# Altium schematic sheet MainCtrl.SchDoc
size A3
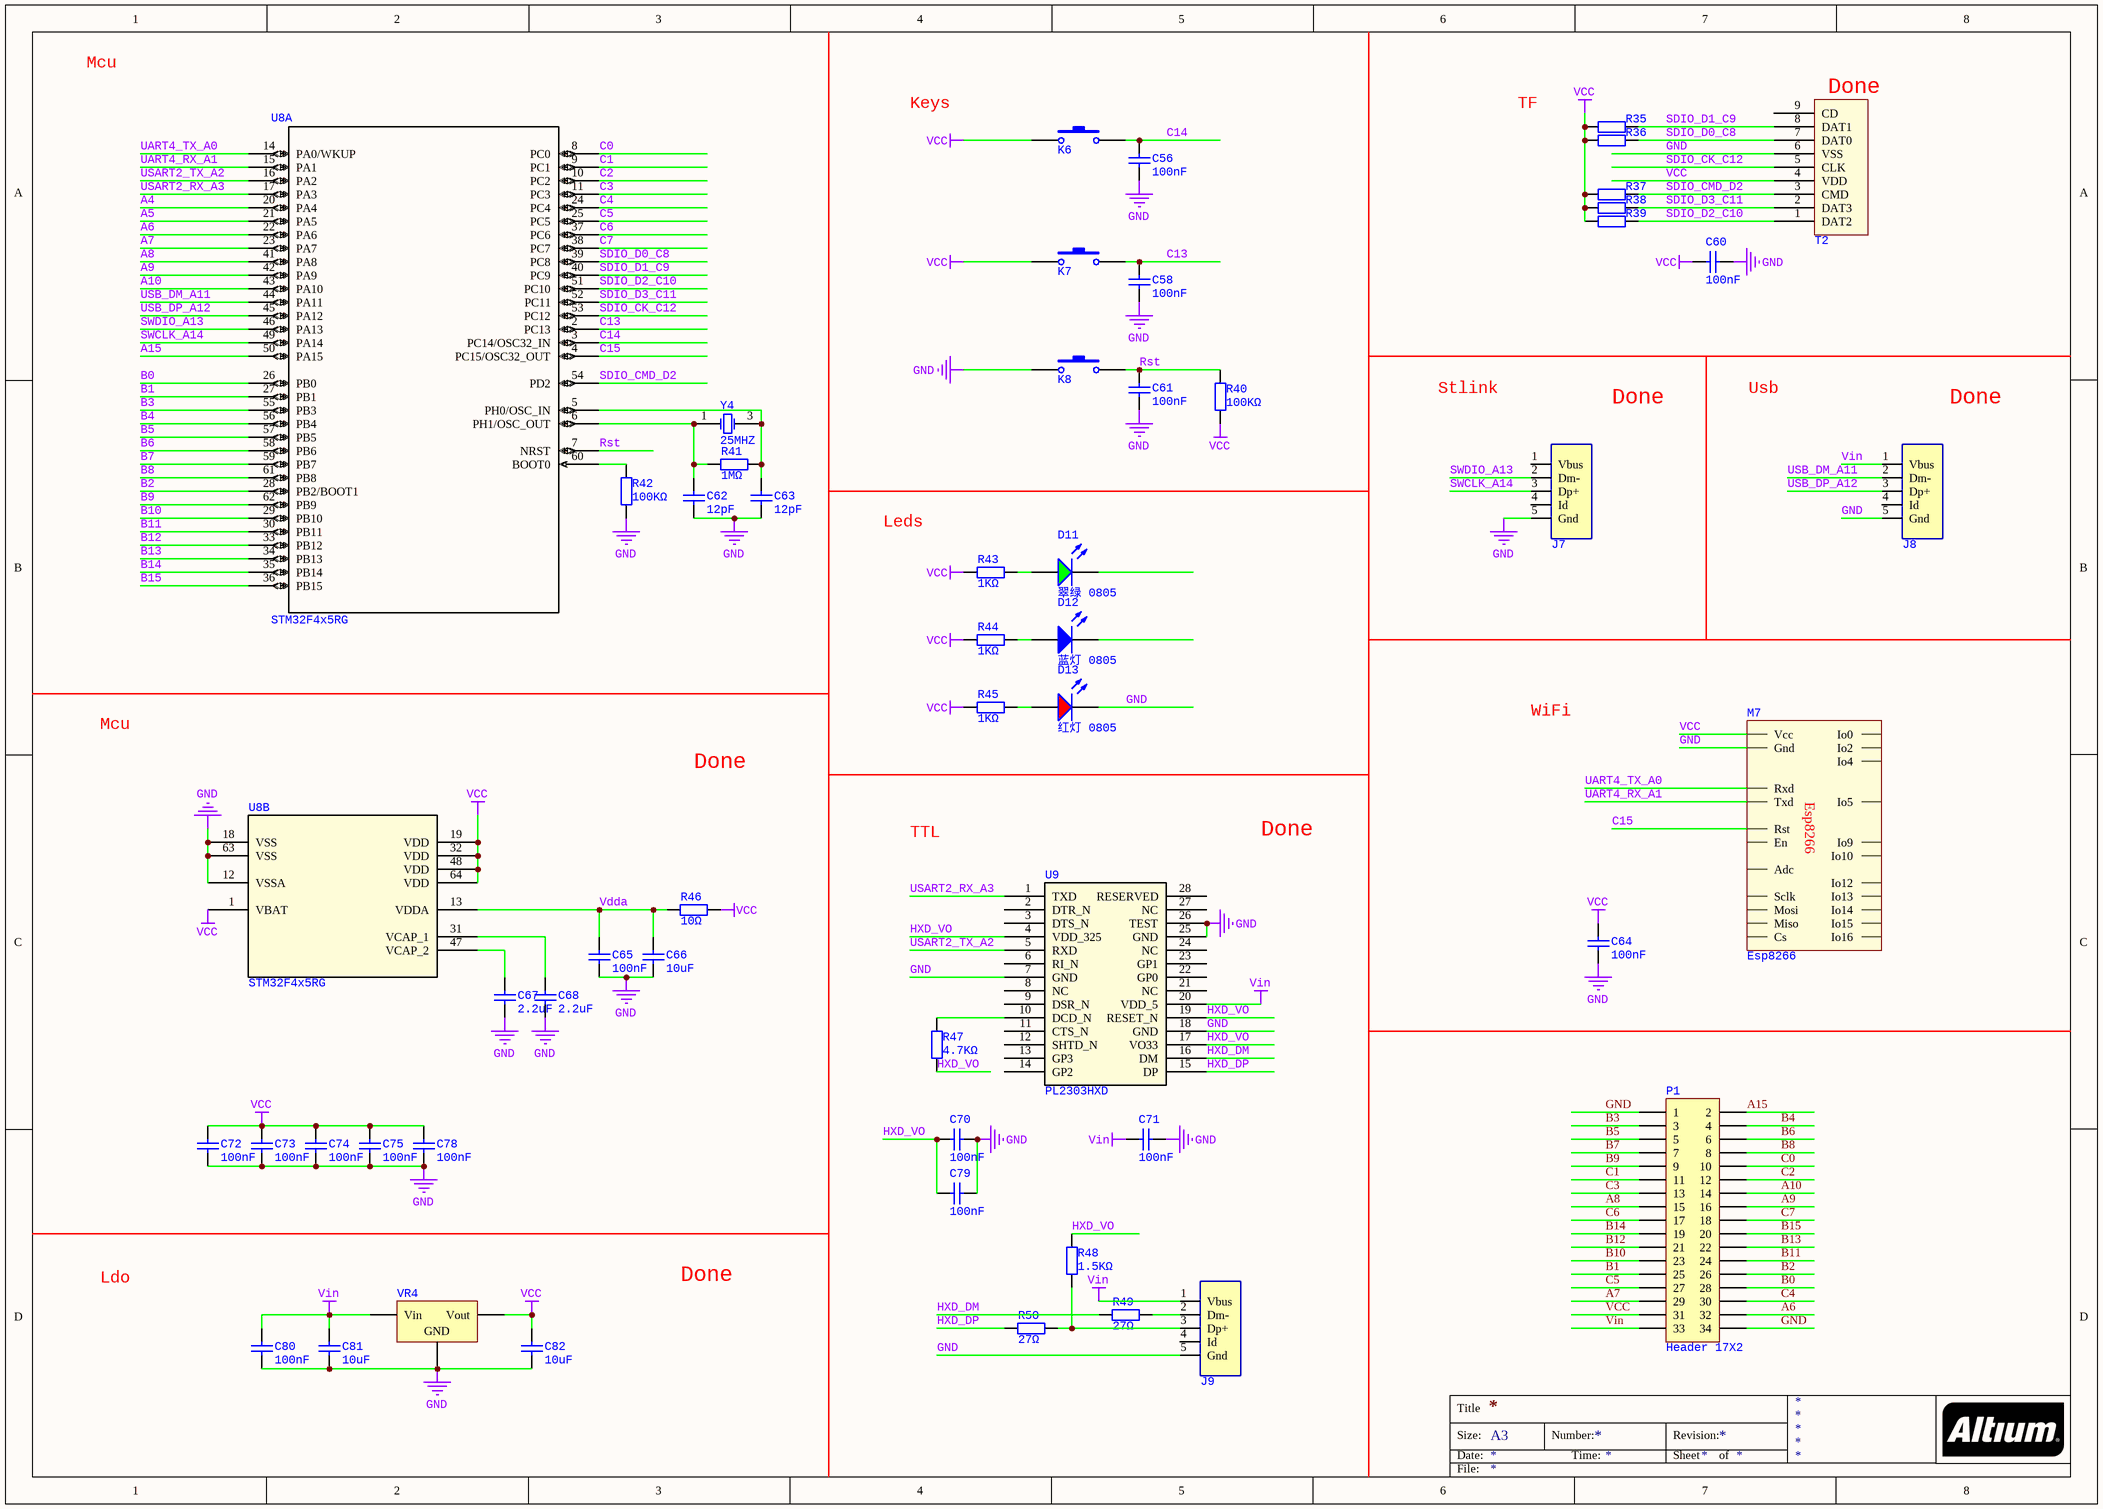
[diagram p0: MainCtrl.SchDoc]

## Parts
C56  100nF  [0603_C]
C58  100nF  [0603_C]
C60  100nF  [0603_C]
C61  100nF  [0603_C]
C62  12pF  [0603_C]
C63  12pF  [0603_C]
C64  100nF  [0603_C]
C65  100nF  [0603_C]
C66  10uF  [0603_C]
C67  2.2uF  [0603_C]
C68  2.2uF  [0603_C]
C70  100nF  [0603_C]
C71  100nF  [0603_C]
C72  100nF  [0603_C]
C73  100nF  [0603_C]
C74  100nF  [0603_C]
C75  100nF  [0603_C]
C78  100nF  [0603_C]
C79  100nF  [0603_C]
C80  100nF  [0603_C]
C81  10uF  [0805_C]
C82  10uF  [0805_C]
D11  翠绿 0805  [0805_LED_S1]
D12  蓝灯 0805  [0805_LED_S1]
D13  红灯 0805  [0805_LED_S1]
J7  UsbOtg  [USB-MINI-A]  (value not drawn)
J8  UsbOtg  [USB-MICRO_E]  (value not drawn)
J9  UsbOtg  [USB-MICRO_E]  (value not drawn)
K6  SW  [SWITCH]  (value not drawn)
K7  SW  [SWITCH]  (value not drawn)
K8  SW  [SWITCH]  (value not drawn)
M7  Esp8266  [ESP8266]
P1  Header 17X2  [P17X2]
R35  47KΩ  [0603_R]  (value not drawn)
R36  47KΩ  [0603_R]  (value not drawn)
R37  47KΩ  [0603_R]  (value not drawn)
R38  47KΩ  [0603_R]  (value not drawn)
R39  47KΩ  [0603_R]  (value not drawn)
R40  100KΩ  [0603_R]
R41  1MΩ  [0603_R]
R42  100KΩ  [0603_R]
R43  1KΩ  [0603_R]
R44  1KΩ  [0603_R]
R45  1KΩ  [0603_R]
R46  10Ω  [0603_R]
R47  4.7KΩ  [0603_R]
R48  1.5KΩ  [0603_R]
R49  27Ω  [0603_R]
R50  27Ω  [0603_R]
T2  TFCard  [TF-CARD]  (value not drawn)
U8  STM32F4x5RG  [LQFP64]  (parts A,B of 2)
U9  PL2303HXD  [SSOP28]
VR4  AMS1117-3.3  [SOT-223]  (value not drawn)
Y4  25MHZ  [SMD-3225_4P]

## Nets
GND: C56.1 C58.1 C60.2 C61.1 C62.1 C63.1 C64.1 C65.1 C66.1 C67.1 C68.1 C70.1 C71.1 C72.1 C73.1 C74.1 C75.1 C78.1 C79.1 C80.1 C81.1 C82.1 D13.K J7.5(Gnd) J8.5(Gnd) J9.5(Gnd) K8.1 M7.15(Gnd) P1.1 P1.34 R42.1 T2.6(VSS) U8.12(VSSA) U8.18(VSS) U8.63(VSS) U9.7(GND) U9.18(GND) U9.25(GND) U9.26(TEST) VR4.1(GND)
VCC: C60.1 C64.2 C72.2 C73.2 C74.2 C75.2 C78.2 C82.2 K6.1 K7.1 M7.8(Vcc) P1.31 R35.1 R36.1 R37.1 R38.1 R39.1 R40.1 R43.2 R44.2 R45.2 R46.2 T2.4(VDD) U8.1(VBAT) U8.19(VDD) U8.32(VDD) U8.48(VDD) U8.64(VDD) VR4.2(Vout)
Vin: C71.2 C80.2 C81.2 J8.1(Vbus) J9.1(Vbus) P1.33 U9.20(VDD_5) VR4.3(Vin)
A4: U8.20(PA4)
A5: U8.21(PA5)
A6: P1.32 U8.22(PA6)
A7: P1.29 U8.23(PA7)
A8: P1.15 U8.41(PA8)
A9: P1.16 U8.42(PA9)
A10: P1.14 U8.43(PA10)
A15: P1.2 U8.50(PA15)
B0: P1.28 U8.26(PB0)
B1: P1.25 U8.27(PB1)
B2: P1.26 U8.28(PB2/BOOT1)
B3: P1.3 U8.55(PB3)
B4: P1.4 U8.56(PB4)
B5: P1.5 U8.57(PB5)
B6: P1.6 U8.58(PB6)
B7: P1.7 U8.59(PB7)
B8: P1.8 U8.61(PB8)
B9: P1.9 U8.62(PB9)
B10: P1.23 U8.29(PB10)
B11: P1.24 U8.30(PB11)
B12: P1.21 U8.33(PB12)
B13: P1.22 U8.34(PB13)
B14: P1.19 U8.35(PB14)
B15: P1.20 U8.36(PB15)
C0: P1.10 U8.8(PC0)
C1: P1.11 U8.9(PC1)
C2: P1.12 U8.10(PC2)
C3: P1.13 U8.11(PC3)
C4: P1.30 U8.24(PC4)
C5: P1.27 U8.25(PC5)
C6: P1.17 U8.37(PC6)
C7: P1.18 U8.38(PC7)
C13: C58.2 K7.2 U8.2(PC13)
C14: C56.2 K6.2 U8.3(PC14/OSC32_IN)
C15: M7.1(Rst) U8.4(PC15/OSC32_OUT)
HXD_DM: R49.1 U9.16(DM)
HXD_DP: R50.1 U9.15(DP)
HXD_VO: C70.2 C79.2 R47.2 R48.2 U9.4(VDD_325) U9.17(VO33) U9.19(RESET_N)
Rst: C61.2 K8.2 R40.2 U8.7(NRST)
SDIO_CK_C12: T2.5(CLK) U8.53(PC12)
SDIO_CMD_D2: R37.2 T2.3(CMD) U8.54(PD2)
SDIO_D0_C8: R36.2 T2.7(DAT0) U8.39(PC8)
SDIO_D1_C9: R35.2 T2.8(DAT1) U8.40(PC9)
SDIO_D2_C10: R39.2 T2.1(DAT2) U8.51(PC10)
SDIO_D3_C11: R38.2 T2.2(DAT3) U8.52(PC11)
SWCLK_A14: J7.3(Dp+) U8.49(PA14)
SWDIO_A13: J7.2(Dm-) U8.46(PA13)
UART4_RX_A1: M7.22(Txd) U8.15(PA1)
UART4_TX_A0: M7.21(Rxd) U8.14(PA0/WKUP)
USART2_RX_A3: U8.17(PA3) U9.1(TXD)
USART2_TX_A2: U8.16(PA2) U9.5(RXD)
USB_DM_A11: J8.2(Dm-) U8.44(PA11)
USB_DP_A12: J8.3(Dp+) U8.45(PA12)
Vdda: C65.2 C66.2 R46.1 U8.13(VDDA)
NetC62_2: C62.2 R41.1 U8.6(PH1/OSC_OUT) Y4.1(OSC1)
NetC63_2: C63.2 R41.2 U8.5(PH0/OSC_IN) Y4.3(OSC2)
NetC67_2: C67.2 U8.47(VCAP_2)
NetC68_2: C68.2 U8.31(VCAP_1)
NetD11_A: D11.A R43.1
NetD12_A: D12.A R44.1
NetD13_A: D13.A R45.1
NetJ9_2: J9.2(Dm-) R49.2
NetJ9_3: J9.3(Dp+) R48.1 R50.2
NetR42_2: R42.2 U8.60(BOOT0)
NetR47_1: R47.1 U9.10(DCD_N)

Not connected (* = marked no-connect by the designer): D11 K; D12 K; J7 1(Vbus) 4(Id); J8 4(Id); J9 4(Id); M7 2(Adc) 3(En) 4(Io16) 5(Io14) 6(Io12) 7(Io13) 9(Sclk) 10(Mosi) 11(Io10) 12(Io9) 13(Miso) 14(Cs) 16(Io15) 17(Io2) 18(Io0) 19(Io4) 20(Io5); T2 9(CD); U9 2(DTR_N) 3(DTS_N) 6(RI_N) 8(NC) 9(DSR_N) 11(CTS_N) 12(SHTD_N) 13(GP3) 14(GP2) 21(NC) 22(GP0) 23(GP1) 24(NC) 27(NC) 28(RESERVED)

## Notes on the sheet
- Mcu
- Keys
- TF
- (near T2) Done
- Stlink
- Done
- Usb
- Leds
- WiFi
- TTL
- Ldo
- Title
- Size:
- Date:
- A3
- Number:
- Time:
- Revision:
- Sheet
- of
- File:

## Library data of the parts
C56 C58 C60 C61 C64 C65 C70-C75 C78-C80 = 0603 100nF (104) 10% 50V: 贴片电容; ComponentLink1Description: 供应商链接; ComponentLink1URL: http://www.szlcsc.com/product/details_15331.html; Package: 0603; Supplier: LC; SuppliersPartNumber: C14663
C62 C63 = 0603 12pF (120) 5% 50V: 贴片电容; ComponentLink1Description: 供应商链接; ComponentLink1URL: http://www.szlcsc.com/product/details_39506.html; Package: 0603; Supplier: LC; SuppliersPartNumber: C38523
C66 = 0603 10uF (106) 10% 10V: 贴片电容; ComponentLink1Description: 供应商链接; ComponentLink1URL: http://www.szlcsc.com/product/details_20411.html; Package: 0603; Supplier: LC; SuppliersPartNumber: C19702
C67 C68 = 0603 2.2uF (225) 10% 16V: 贴片电容; ComponentLink1Description: 供应商链接; ComponentLink1URL: http://www.szlcsc.com/product/details_24366.html; Package: 0603; Supplier: LC; SuppliersPartNumber: C23630
C81 C82 = 0805 10uF (106) 10% 25V: 贴片电容; ComponentLink1Description: 供应商链接; ComponentLink1URL: http://www.szlcsc.com/product/details_16532.html; Package: 0805; Supplier: LC; SuppliersPartNumber: C15850
D11 = 0805 翠绿: 发光二极管; ComponentLink1Description: 供应商链接; ComponentLink1URL: http://www.szlcsc.com/product/details_2670.html; Package: 0805; Supplier: LC; SuppliersPartNumber: C2297
D12 = 0805 蓝灯: 发光二极管; ComponentLink1Description: 供应商链接; ComponentLink1URL: http://www.szlcsc.com/product/details_2666.html; Package: 0805; Supplier: LC; SuppliersPartNumber: C2293
D13 = 0805 红灯: 发光二极管; ComponentLink1Description: 供应商链接; ComponentLink1URL: http://www.szlcsc.com/product/details_2668.html; Package: 0805; Supplier: LC; SuppliersPartNumber: C2295
K6-K8 = SW: Switch
P1 = Header 17X2: Header, 17-Pin, Dual row; LatestRevisionDate: 17-Jul-2002; LatestRevisionNote: Re-released for DXP Platform.; Publisher: Altium Limited
R35-R39 = 0603 47KΩ (4702) 1%: 贴片电阻; ComponentLink1Description: 供应商链接; ComponentLink1URL: http://www.szlcsc.com/product/details_26562.html; Package: 0603; Supplier: LC; SuppliersPartNumber: C25819
R40 R42 = 0603 100KΩ (1003) 1%: 贴片电阻; ComponentLink1Description: 供应商链接; ComponentLink1URL: http://www.szlcsc.com/product/details_26546.html; Package: 0603; Supplier: LC; SuppliersPartNumber: C25803
R41 = 0603 1MΩ (1004) 1%: 贴片电阻; ComponentLink1Description: 供应商链接; ComponentLink1URL: http://www.szlcsc.com/product/details_23662.html; Package: 0603; Supplier: LC; SuppliersPartNumber: C22935
R43-R45 R47-R50 = 0603 10KΩ (1002) 1%: 贴片电阻; ComponentLink1Description: 供应商链接; ComponentLink1URL: http://www.szlcsc.com/product/details_26547.html; Package: 0603; Supplier: LC; SuppliersPartNumber: C25804
R46 = 0603 10Ω (10R0) 1%: 贴片电阻; ComponentLink1Description: 供应商链接; ComponentLink1URL: http://www.szlcsc.com/product/details_23586.html; Package: 0603; Supplier: LC; SuppliersPartNumber: C22859
U8 = STM32F4x5RG: Mcu; Vendor: STMicroelectronics; C: Copyright (C) 2016 Accelerated Designs. All rights reserved; Manufacturer_Part_Number: stm32f4x5rg; Copyright: Copyright (C) 2016 Accelerated Designs. All rights reserved; RefDes: RefDes; Type: Type; Value: Value
U9 = PL2303HXD: Driver; Manufacturer_Part_Number: tlc5916-q1_d_16; GENERIC_PART_NUMBER: TLC5916-Q1; Vendor: Texas Instruments; PACKAGE_DESIGNATOR: D; PIN_COUNT: 16; FAMILY_NAME: LED DRIVER; INDUSTRY_STD_PKG_TYPE: SOIC; Manufacturer: Texas Instruments; Datasheet_URL: http://www.ti.com/lit/gpn/TLC5916-Q1; Value: Value; Type: Type; RefDes: RefDes
VR4 = SOT-223 AMS1117-3.3: 低压差线性稳压(LDO); ComponentLink1Description: 供应商链接; ComponentLink1URL: http://www.szlcsc.com/product/details_6652.html; Package: SOT-223; Supplier: LC; SuppliersPartNumber: C6186
Y4 = SMD-3225_4P  25MHZ 12PF 10PPM: 贴片晶振; ComponentLink1Description: 供应商链接; ComponentLink1URL: http://www.szlcsc.com/product/details_9526.html; Package: SMD-3225_4P; Supplier: LC; SuppliersPartNumber: C9006